# EAGLE design 3-channel_geo_amplifier (EAGLE 7.2.0)
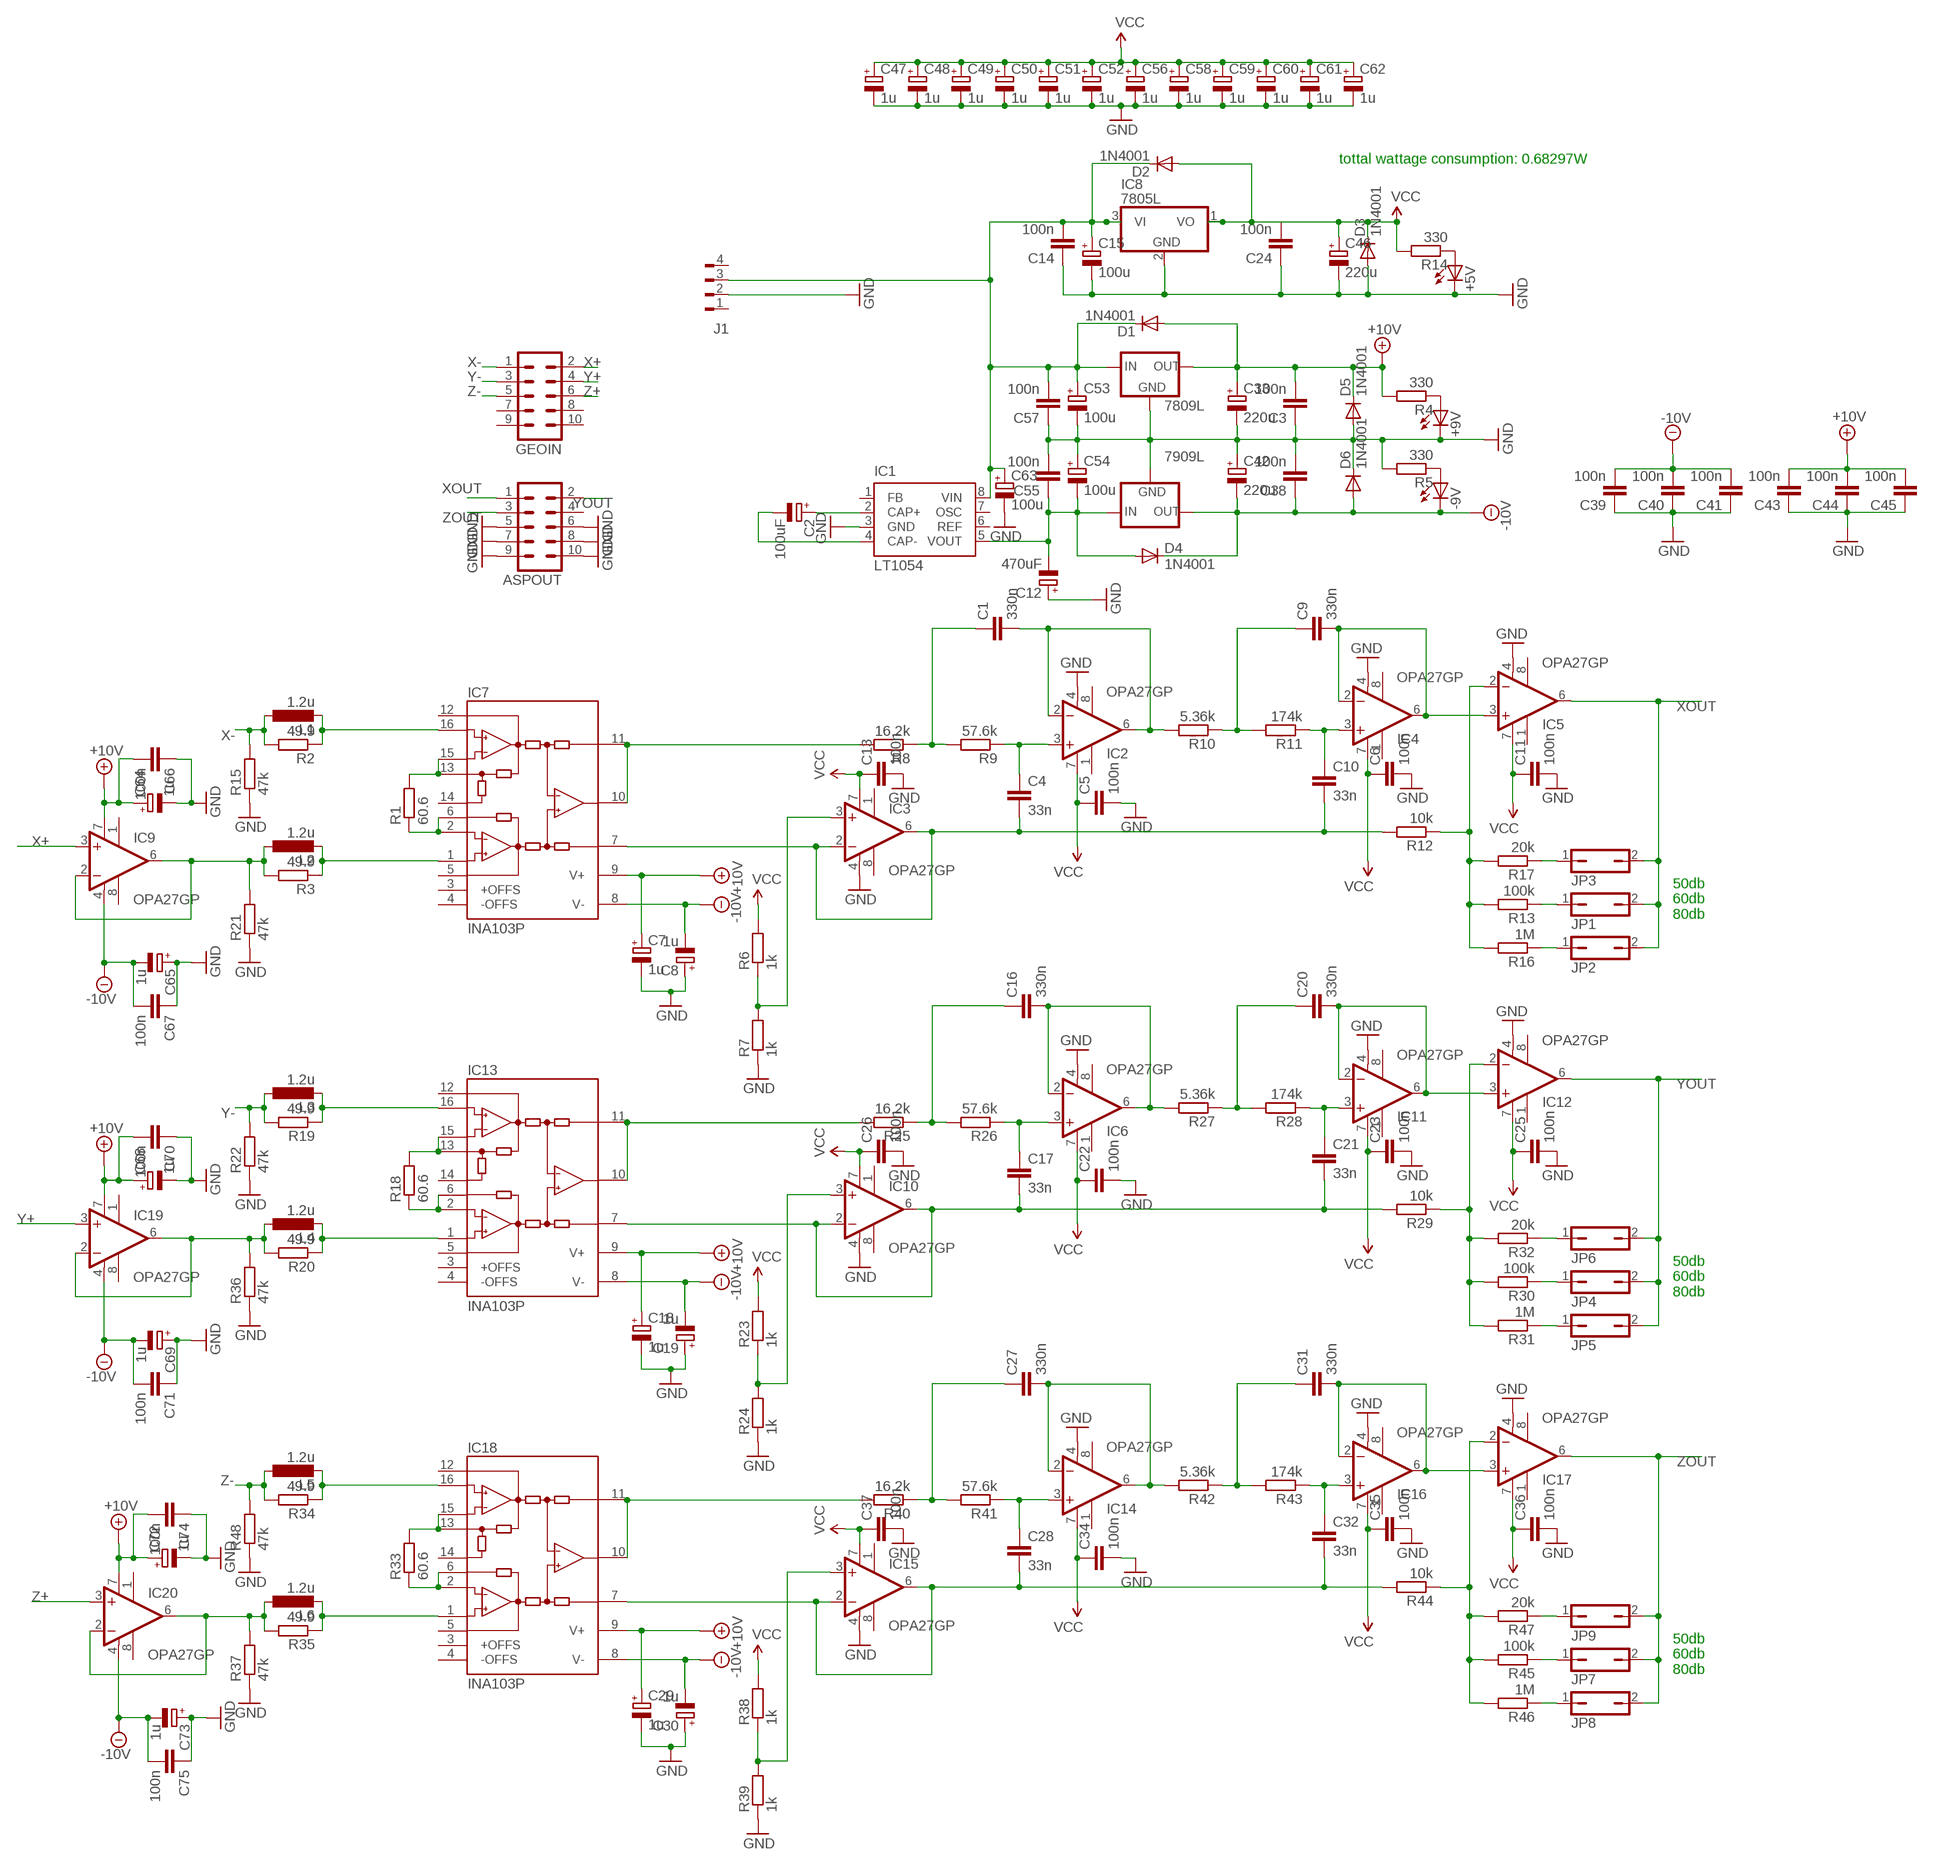
[diagram p0: schematic, sheet 1]

## Parts
7809L  78LXX  [78LXX]
7909L  79LXX  [79LXX]
+5V  LED3MM  [LED3MM]
+9V  LED3MM  [LED3MM]
-9V  LED3MM  [LED3MM]
ASPOUT  ML10  [ML10]
C1  330n  C-EU050-025X075  [C050-025X075]
C2  100uF  CPOL-EUE2.5-7  [E2,5-7]
C3  100n  C-EU050-025X075  [C050-025X075]
C4  33n  C-EU050-025X075  [C050-025X075]
C5  100n  C-EU050-025X075  [C050-025X075]
C6  100n  C-EU050-025X075  [C050-025X075]
C7  1u  CPOL-EUB45181A  [B45181A]
C8  1u  CPOL-EUB45181A  [B45181A]
C9  330n  C-EU050-025X075  [C050-025X075]
C10  33n  C-EU050-025X075  [C050-025X075]
C11  100n  C-EU050-025X075  [C050-025X075]
C12  470uF  CPOL-EUE5-8.5  [E5-8,5]
C13  100n  C-EU050-025X075  [C050-025X075]
C14  100n  C-EU050-025X075  [C050-025X075]
C15  100u  CPOL-EUE2.5-7  [E2,5-7]
C16  330n  C-EU050-025X075  [C050-025X075]
C17  33n  C-EU050-025X075  [C050-025X075]
C18  1u  CPOL-EUB45181A  [B45181A]
C19  1u  CPOL-EUB45181A  [B45181A]
C20  330n  C-EU050-025X075  [C050-025X075]
C21  33n  C-EU050-025X075  [C050-025X075]
C22  100n  C-EU050-025X075  [C050-025X075]
C23  100n  C-EU050-025X075  [C050-025X075]
C24  100n  C-EU050-025X075  [C050-025X075]
C25  100n  C-EU050-025X075  [C050-025X075]
C26  100n  C-EU050-025X075  [C050-025X075]
C27  330n  C-EU050-025X075  [C050-025X075]
C28  33n  C-EU050-025X075  [C050-025X075]
C29  1u  CPOL-EUB45181A  [B45181A]
C30  1u  CPOL-EUB45181A  [B45181A]
C31  330n  C-EU050-025X075  [C050-025X075]
C32  33n  C-EU050-025X075  [C050-025X075]
C33  220u  CPOL-EUE2.5-5  [E2,5-5]
C34  100n  C-EU050-025X075  [C050-025X075]
C35  100n  C-EU050-025X075  [C050-025X075]
C36  100n  C-EU050-025X075  [C050-025X075]
C37  100n  C-EU050-025X075  [C050-025X075]
C38  100n  C-EU050-025X075  [C050-025X075]
C39  100n  C-EU050-025X075  [C050-025X075]
C40  100n  C-EU050-025X075  [C050-025X075]
C41  100n  C-EU050-025X075  [C050-025X075]
C42  220u  CPOL-EUE2.5-5  [E2,5-5]
C43  100n  C-EU050-025X075  [C050-025X075]
C44  100n  C-EU050-025X075  [C050-025X075]
C45  100n  C-EU050-025X075  [C050-025X075]
C46  220u  CPOL-EUE2.5-7  [E2,5-7]
C47  1u  CPOL-EUB45181A  [B45181A]
C48  1u  CPOL-EUB45181A  [B45181A]
C49  1u  CPOL-EUB45181A  [B45181A]
C50  1u  CPOL-EUB45181A  [B45181A]
C51  1u  CPOL-EUB45181A  [B45181A]
C52  1u  CPOL-EUB45181A  [B45181A]
C53  100u  CPOL-EUE2.5-5  [E2,5-5]
C54  100u  CPOL-EUE2.5-5  [E2,5-5]
C55  100n  C-EU050-025X075  [C050-025X075]
C56  1u  CPOL-EUB45181A  [B45181A]
C57  100n  C-EU050-025X075  [C050-025X075]
C58  1u  CPOL-EUB45181A  [B45181A]
C59  1u  CPOL-EUB45181A  [B45181A]
C60  1u  CPOL-EUB45181A  [B45181A]
C61  1u  CPOL-EUB45181A  [B45181A]
C62  1u  CPOL-EUB45181A  [B45181A]
C63  100u  CPOL-EUE2.5-5  [E2,5-5]
C64  1u  CPOL-EUB45181A  [B45181A]
C65  1u  CPOL-EUB45181A  [B45181A]
C66  100n  C-EU050-025X075  [C050-025X075]
C67  100n  C-EU050-025X075  [C050-025X075]
C68  1u  CPOL-EUB45181A  [B45181A]
C69  1u  CPOL-EUB45181A  [B45181A]
C70  100n  C-EU050-025X075  [C050-025X075]
C71  100n  C-EU050-025X075  [C050-025X075]
C72  1u  CPOL-EUB45181A  [B45181A]
C73  1u  CPOL-EUB45181A  [B45181A]
C74  100n  C-EU050-025X075  [C050-025X075]
C75  100n  C-EU050-025X075  [C050-025X075]
D1  1N4001  1N4004  [DO41-10]
D2  1N4001  1N4004  [DO41-10]
D3  1N4001  1N4004  [DO41-10]
D4  1N4001  1N4004  [DO41-10]
D5  1N4001  1N4004  [DO41-10]
D6  1N4001  1N4004  [DO41-10]
GEOIN  ML10  [ML10]
IC1  LT1054  [DIL8]
IC2  OPA27GP  [DIL08]
IC3  OPA27GP  [DIL08]
IC4  OPA27GP  [DIL08]
IC5  OPA27GP  [DIL08]
IC6  OPA27GP  [DIL08]
IC7  INA103P  [DIL16]
IC8  7805L  [TO92]
IC9  OPA27GP  [DIL08]
IC10  OPA27GP  [DIL08]
IC11  OPA27GP  [DIL08]
IC12  OPA27GP  [DIL08]
IC13  INA103P  [DIL16]
IC14  OPA27GP  [DIL08]
IC15  OPA27GP  [DIL08]
IC16  OPA27GP  [DIL08]
IC17  OPA27GP  [DIL08]
IC18  INA103P  [DIL16]
IC19  OPA27GP  [DIL08]
IC20  OPA27GP  [DIL08]
J1  FLOP-4W827001  [827001]
JP1  JP1Q  [JP1]
JP2  JP1Q  [JP1]
JP3  JP1Q  [JP1]
JP4  JP1Q  [JP1]
JP5  JP1Q  [JP1]
JP6  JP1Q  [JP1]
JP7  JP1Q  [JP1]
JP8  JP1Q  [JP1]
JP9  JP1Q  [JP1]
L1  1.2u  L-EU0207/10  [0207/10]
L2  1.2u  L-EU0207/10  [0207/10]
L3  1.2u  L-EU0207/10  [0207/10]
L4  1.2u  L-EU0207/10  [0207/10]
L5  1.2u  L-EU0207/10  [0207/10]
L6  1.2u  L-EU0207/10  [0207/10]
R1  60.6  R-EU_0207/10  [0207/10]
R2  49.9  R-EU_0207/10  [0207/10]
R3  49.9  R-EU_0207/10  [0207/10]
R4  330  R-EU_0207/10  [0207/10]
R5  330  R-EU_0207/10  [0207/10]
R6  1k  R-EU_0207/10  [0207/10]
R7  1k  R-EU_0207/10  [0207/10]
R8  16.2k  R-EU_0207/10  [0207/10]
R9  57.6k  R-EU_0207/10  [0207/10]
R10  5.36k  R-EU_0207/10  [0207/10]
R11  174k  R-EU_0207/10  [0207/10]
R12  10k  R-EU_0207/10  [0207/10]
R13  100k  R-EU_0207/10  [0207/10]
R14  330  R-EU_0207/10  [0207/10]
R15  47k  R-EU_0207/10  [0207/10]
R16  1M  R-EU_0207/10  [0207/10]
R17  20k  R-EU_0207/10  [0207/10]
R18  60.6  R-EU_0207/10  [0207/10]
R19  49.9  R-EU_0207/10  [0207/10]
R20  49.9  R-EU_0207/10  [0207/10]
R21  47k  R-EU_0207/10  [0207/10]
R22  47k  R-EU_0207/10  [0207/10]
R23  1k  R-EU_0207/10  [0207/10]
R24  1k  R-EU_0207/10  [0207/10]
R25  16.2k  R-EU_0207/10  [0207/10]
R26  57.6k  R-EU_0207/10  [0207/10]
R27  5.36k  R-EU_0207/10  [0207/10]
R28  174k  R-EU_0207/10  [0207/10]
R29  10k  R-EU_0207/10  [0207/10]
R30  100k  R-EU_0207/10  [0207/10]
R31  1M  R-EU_0207/10  [0207/10]
R32  20k  R-EU_0207/10  [0207/10]
R33  60.6  R-EU_0207/10  [0207/10]
R34  49.9  R-EU_0207/10  [0207/10]
R35  49.9  R-EU_0207/10  [0207/10]
R36  47k  R-EU_0207/10  [0207/10]
R37  47k  R-EU_0207/10  [0207/10]
R38  1k  R-EU_0207/10  [0207/10]
R39  1k  R-EU_0207/10  [0207/10]
R40  16.2k  R-EU_0207/10  [0207/10]
R41  57.6k  R-EU_0207/10  [0207/10]
R42  5.36k  R-EU_0207/10  [0207/10]
R43  174k  R-EU_0207/10  [0207/10]
R44  10k  R-EU_0207/10  [0207/10]
R45  100k  R-EU_0207/10  [0207/10]
R46  1M  R-EU_0207/10  [0207/10]
R47  20k  R-EU_0207/10  [0207/10]
R48  47k  R-EU_0207/10  [0207/10]

## Nets
+10V [power]: 7809L.OUT C3.2 C7.+ C18.+ C29.+ C33.+ C43.2 C44.2 C45.2 C64.+ C66.2 C68.+ C70.2 C72.+ C74.2 D1.A D5.C IC7.9(V+) IC9.7(V+) IC13.9(V+) IC18.9(V+) IC19.7(V+) IC20.7(V+) R4.2
-10V [power]: 7909L.OUT -9V.K(C) C8.- C19.- C30.- C38.1 C39.2 C40.2 C41.2 C42.- C65.- C67.2 C69.- C71.2 C73.- C75.2 D4.C D6.A IC7.8(V-) IC9.4(V-) IC13.8(V-) IC18.8(V-) IC19.4(V-) IC20.4(V-)
A: IC20.2(-IN) IC20.6(OUT) L6.1 R35.2 R37.2
GND [power]: 7809L.GND 7909L.GND +5V.K(C) +9V.K(C) ASPOUT.5 ASPOUT.6 ASPOUT.7 ASPOUT.8 ASPOUT.9 ASPOUT.10 C3.1 C5.2 C6.2 C7.- C8.+ C11.2 C12.+ C13.2 C14.1 C15.- C18.- C19.+ C22.2 C23.2 C24.1 C25.2 C26.2 C29.- C30.+ C33.- C34.2 C35.2 C36.2 C37.2 C38.2 C39.1 C40.1 C41.1 C42.+ C43.1 C44.1 C45.1 C46.- C47.- C48.- C49.- C50.- C51.- C52.- C53.- C54.+ C55.2 C56.- C57.1 C58.- C59.- C60.- C61.- C62.- C63.- C64.- C65.+ C66.1 C67.1 C68.- C69.+ C70.1 C71.1 C72.- C73.+ C74.1 C75.1 D3.A D5.A D6.C IC1.3(GND) IC2.4(V-) IC3.4(V-) IC4.4(V-) IC5.4(V-) IC6.4(V-) IC8.2(GND) IC10.4(V-) IC11.4(V-) IC12.4(V-) IC14.4(V-) IC15.4(V-) IC16.4(V-) IC17.4(V-) J1.2 R5.2 R7.1 R15.1 R21.1 R22.1 R24.1 R36.1 R37.1 R39.1 R48.1
N$1: IC7.13(-RG) IC7.15(-GS) R1.2
N$2: IC7.2(+GS) IC7.6(+RG) R1.1
N$3: IC7.1(+IN) L2.2 R3.1
N$4: IC19.2(-IN) IC19.6(OUT) L4.1 R20.2 R36.2
N$6: IC7.16(-IN) L1.2 R2.1
N$7: C4.2 C10.2 IC3.2(-IN) IC3.6(OUT) IC7.7(REF) R12.2
N$8: IC3.3(+IN) R6.1 R7.2
N$9: IC7.10(OUT) IC7.11(SENSE) R8.2
N$10: C1.1 R8.1 R9.2
N$11: C4.1 IC2.3(+IN) R9.1
N$12: C1.2 IC2.2(-IN) IC2.6(OUT) R10.2
N$13: C9.2 IC4.2(-IN) IC4.6(OUT) IC5.3(+IN)
N$14: C9.1 R10.1 R11.2
N$15: C10.1 IC4.3(+IN) R11.1
N$16: +5V.A R14.1
N$17: IC5.2(-IN) R12.1 R13.2 R16.2 R17.2
N$18: JP1.1 R13.1
N$19: IC9.2(-IN) IC9.6(OUT) L2.1 R3.2 R21.2
N$20: +9V.A R4.1
N$21: IC13.13(-RG) IC13.15(-GS) R18.2
N$22: JP2.1 R16.1
N$23: IC13.2(+GS) IC13.6(+RG) R18.1
N$24: JP3.1 R17.1
N$25: IC13.1(+IN) L4.2 R20.1
N$26: C2.- IC1.4(CAP-)
N$27: C2.+ IC1.2(CAP+)
N$28: IC13.16(-IN) L3.2 R19.1
N$29: C17.2 C21.2 IC10.2(-IN) IC10.6(OUT) IC13.7(REF) R29.2
N$30: IC10.3(+IN) R23.1 R24.2
N$31: IC13.10(OUT) IC13.11(SENSE) R25.2
N$32: C16.1 R25.1 R26.2
N$33: C17.1 IC6.3(+IN) R26.1
N$34: C16.2 IC6.2(-IN) IC6.6(OUT) R27.2
N$35: C20.1 R27.1 R28.2
N$36: C21.1 IC11.3(+IN) R28.1
N$37: C20.2 IC11.2(-IN) IC11.6(OUT) IC12.3(+IN)
N$38: IC12.2(-IN) R29.1 R30.2 R31.2 R32.2
N$39: -9V.A R5.1
N$40: JP4.1 R30.1
N$41: JP5.1 R31.1
N$42: JP6.1 R32.1
N$43: IC18.13(-RG) IC18.15(-GS) R33.2
N$44: IC18.2(+GS) IC18.6(+RG) R33.1
N$45: IC18.1(+IN) L6.2 R35.1
N$46 [power]: 7809L.IN C14.2 C15.+ C53.+ C57.2 C63.+ D1.C D2.C IC1.8(VIN) IC8.3(VI) J1.3
N$52: IC18.16(-IN) L5.2 R34.1
N$53: C28.2 C32.2 IC15.2(-IN) IC15.6(OUT) IC18.7(REF) R44.2
N$54: IC15.3(+IN) R38.1 R39.2
N$55: IC18.10(OUT) IC18.11(SENSE) R40.2
N$56: C27.1 R40.1 R41.2
N$57: C28.1 IC14.3(+IN) R41.1
N$58 [power]: 7909L.IN C12.- C54.- C55.1 D4.A IC1.5(VOUT)
N$60: C27.2 IC14.2(-IN) IC14.6(OUT) R42.2
N$61: C31.1 R42.1 R43.2
N$62: C32.1 IC16.3(+IN) R43.1
N$63: C31.2 IC16.2(-IN) IC16.6(OUT) IC17.3(+IN)
N$64: IC17.2(-IN) R44.1 R45.2 R46.2 R47.2
N$66: JP7.1 R45.1
N$67: JP8.1 R46.1
N$68: JP9.1 R47.1
VCC [power]: C5.1 C6.1 C11.1 C13.1 C22.1 C23.1 C24.2 C25.1 C26.1 C34.1 C35.1 C36.1 C37.1 C46.+ C47.+ C48.+ C49.+ C50.+ C51.+ C52.+ C56.+ C58.+ C59.+ C60.+ C61.+ C62.+ D2.A D3.C IC2.7(V+) IC3.7(V+) IC4.7(V+) IC5.7(V+) IC6.7(V+) IC8.1(VO) IC10.7(V+) IC11.7(V+) IC12.7(V+) IC14.7(V+) IC15.7(V+) IC16.7(V+) IC17.7(V+) R6.2 R14.2 R23.2 R38.2
X+: GEOIN.2 IC9.3(+IN)
X-: GEOIN.1 L1.1 R2.2 R15.2
XOUT: ASPOUT.1 IC5.6(OUT) JP1.2 JP2.2 JP3.2
Y+: GEOIN.4 IC19.3(+IN)
Y-: GEOIN.3 L3.1 R19.2 R22.2
YOUT: ASPOUT.2 IC12.6(OUT) JP4.2 JP5.2 JP6.2
Z+: GEOIN.6 IC20.3(+IN)
Z-: GEOIN.5 L5.1 R34.2 R48.2
ZOUT: ASPOUT.3 IC17.6(OUT) JP7.2 JP8.2 JP9.2
Unconnected: ASPOUT.4 GEOIN.7 GEOIN.8 GEOIN.9 GEOIN.10 IC1.1(FB) IC1.6(REF) IC1.7(OSC) IC2.1(OFF1) IC2.8(OFF2) IC3.1(OFF1) IC3.8(OFF2) IC4.1(OFF1) IC4.8(OFF2) IC5.1(OFF1) IC5.8(OFF2) IC6.1(OFF1) IC6.8(OFF2) IC7.3(+OFFS) IC7.4(-OFFS) IC7.5(+GD) IC7.12(-GD) IC7.14(G=100) IC9.1(OFF1) IC9.8(OFF2) IC10.1(OFF1) IC10.8(OFF2) IC11.1(OFF1) IC11.8(OFF2) IC12.1(OFF1) IC12.8(OFF2) IC13.3(+OFFS) IC13.4(-OFFS) IC13.5(+GD) IC13.12(-GD) IC13.14(G=100) IC14.1(OFF1) IC14.8(OFF2) IC15.1(OFF1) IC15.8(OFF2) IC16.1(OFF1) IC16.8(OFF2) IC17.1(OFF1) IC17.8(OFF2) IC18.3(+OFFS) IC18.4(-OFFS) IC18.5(+GD) IC18.12(-GD) IC18.14(G=100) IC19.1(OFF1) IC19.8(OFF2) IC20.1(OFF1) IC20.8(OFF2) J1.1 J1.4

## Notes on the sheet
- tottal wattage consumption: 0.68297W
- 50db
  60db
  80db
- 50db
  60db
  80db
- 50db
  60db
  80db

## Library data of the parts
7809L = v-reg:78LXX: VOLTAGE REGULATOR
7909L = v-reg:79LXX: VOLTAGE REGULATOR
+5V +9V -9V = led:LED: LED OSRAM: - CHIPLED LG R971, LG N971, LY N971, LG Q971, LY Q971, LO R971, LY R971 LH N974, LH R974 LS Q976, LO Q976, LY Q976 LO Q996 - Hyper CHIPLED LW Q18S LB Q993, LB Q99A, LB R99A - SideLED LS A670, LO A670, LY A670, LG A670, LP A670 LB A673, LV A673, LT A673, LW A673 LH A674 LY A675 LS A676, LA A676, LO A676, LY A676, LW A676 LS A679, LY A679, LG A679 - Hyper Micro SIDELED® LS Y876, LA Y876, LO Y876, LY Y876 LT Y87S - SmartLED LW L88C, LW L88S LB L89C, LB L89S, LG L890 LS L89K, LO L89K, LY L89K LS L896, LA L896, LO L896, LY L896 - TOPLED LS T670, LO T670, LY T670, LG T670, LP T670 LSG T670, LSP T670, LSY T670, LOP T670, LYG T670 LG T671, LOG T671, LSG T671 LB T673, LV T673, LT T673, LW T673 LH T674 LS T676, LA T676, LO T676, LY T676, LB T676, LH T676, LSB T676, LW T676 LB T67C, LV T67C, LT T67C, LS T67K, LO T67K, LY T67K, LW E67C LS E67B, LA E67B, LO E67B, LY E67B, LB E67C, LV E67C, LT E67C LW T67C LS T679, LY T679, LG T679 LS T770, LO T770, LY T770, LG T770, LP T770 LB T773, LV T773, LT T773, LW T773 LH T774 LS E675, LA E675, LY E675, LS T675 LS T776, LA T776, LO T776, LY T776, LB T776 LHGB T686 LT T68C, LB T68C - Hyper Mini TOPLED® LB M676 - Mini TOPLED Santana® LG M470 LS M47K, LO M47K, LY M47K Source: http://www.osram.convergy.de LUXEON: - LUMILED® LXK2-PW12-R00, LXK2-PW12-S00, LXK2-PW14-U00, LXK2-PW14-V00 LXK2-PM12-R00, LXK2-PM12-S00, LXK2-PM14-U00 LXK2-PE12-Q00, LXK2-PE12-R00, LXK2-PE12-S00, LXK2-PE14-T00, LXK2-PE14-U00 LXK2-PB12-K00, LXK2-PB12-L00, LXK2-PB12-M00, LXK2-PB14-N00, LXK2-PB14-P00, LXK2-PB14-Q00 LXK2-PR12-L00, LXK2-PR12-M00, LXK2-PR14-Q00, LXK2-PR14-R00 LXK2-PD12-Q00, LXK2-PD12-R00, LXK2-PD12-S00 LXK2-PH12-R00, LXK2-PH12-S00 LXK2-PL12-P00, LXK2-PL12-Q00, LXK2-PL12-R00 Source: www.luxeon.com KINGBRIGHT: KA-3528ASYC Source: www.kingbright.com
ASPOUT GEOIN = con-ml:ML10: HARTING; OC_FARNELL: unknown; OC_NEWARK: unknown
C1 C3-C6 C9-C11 C13 C14 C16 C17 C20-C28 C31 C32 C34-C41 C43-C45 C55 C57 C66 C67 C70 C71 C74 C75 = rcl:C-EU: CAPACITOR, European symbol
C2 C7 C8 C12 C15 C18 C19 C29 C30 C33 C42 C46-C54 C56 C58-C65 C68 C69 C72 C73 = rcl:CPOL-EU: POLARIZED CAPACITOR, European symbol
D1-D6 = diode:1N4004: DIODE general purpose rectifier, 1 A
IC1 = mylib2:LT1054
IC2-IC6 IC9-IC12 IC14-IC17 IC19 IC20 = linear:OPA*?: Ultra-Low Noise, Precision OP AMP Source: http://focus.ti.com/lit/ds/symlink/opa27.pdf http://focus.ti.com .. opa241.pdf
IC7 IC13 IC18 = burr-brown:INA103: Instrumentation Amplifier Low Distortion, Low Noise; MF: TEXAS INSTRUMENTS; MPN: INA103KP; OC_FARNELL: 1212392; OC_NEWARK: 74K3805
IC8 = linear:78*: Positive VOLTAGE REGULATOR Source: http://cache.national.com/ds/LM/LM78L05.pdf http://www.fairchildsemi.com/ds/LM/LM7805.pdf
J1 = con-amp:FLOP-4W: MATE N-LOCK Floppy / HDD conector Distributor: Bürklin 71F972
JP1-JP9 = jumper:JP1Q: JUMPER
L1-L6 = rcl:L-EU: INDUCTOR, European symbol
R1-R48 = rcl:R-EU_: RESISTOR, European symbol

## Net classes
0 default: clearance 0.205 mm
2 power: width 0.559 mm, clearance 0.205 mm to class 0, clearance 0.205 mm to class 1, clearance 0.205 mm
3 extra_power: width 0.762 mm, clearance 0.203 mm

## Board
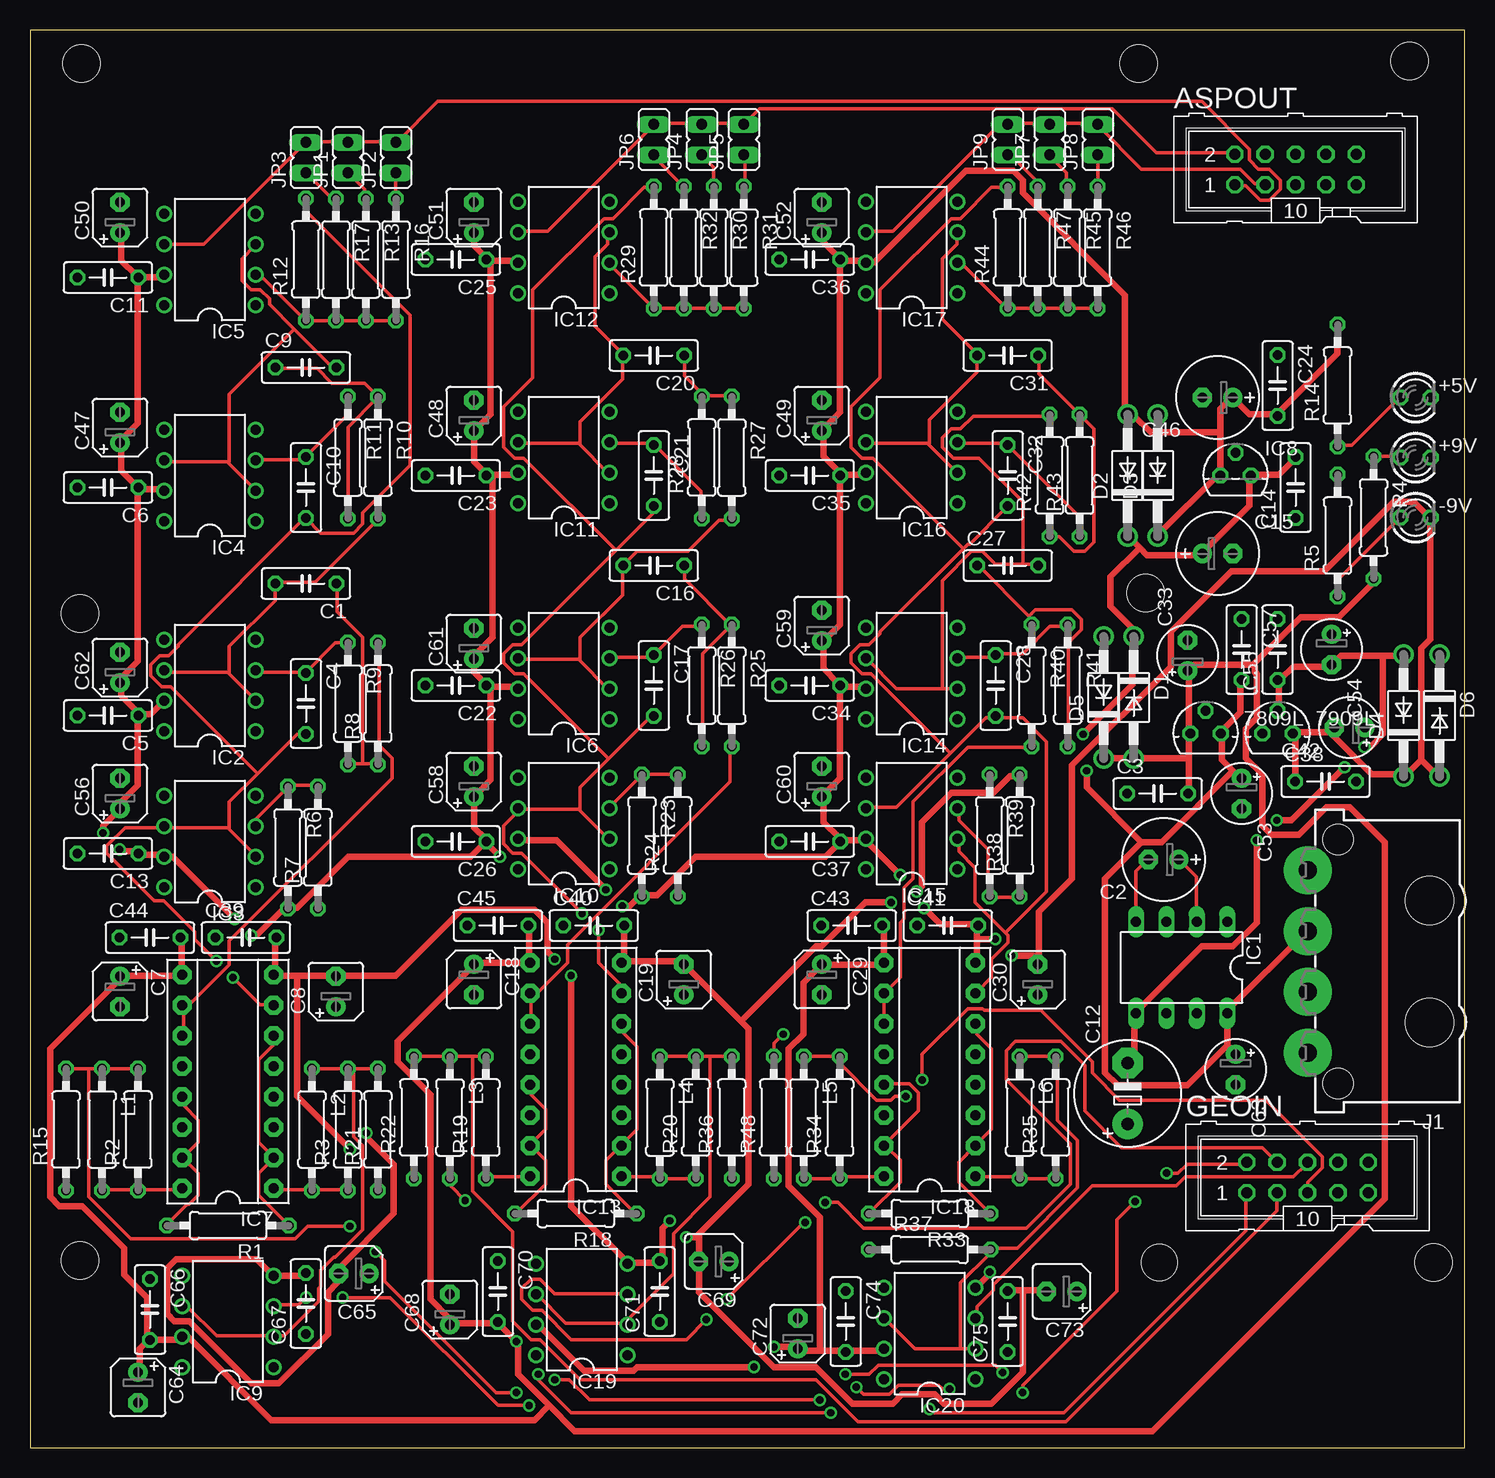
[diagram p1: board, top side]
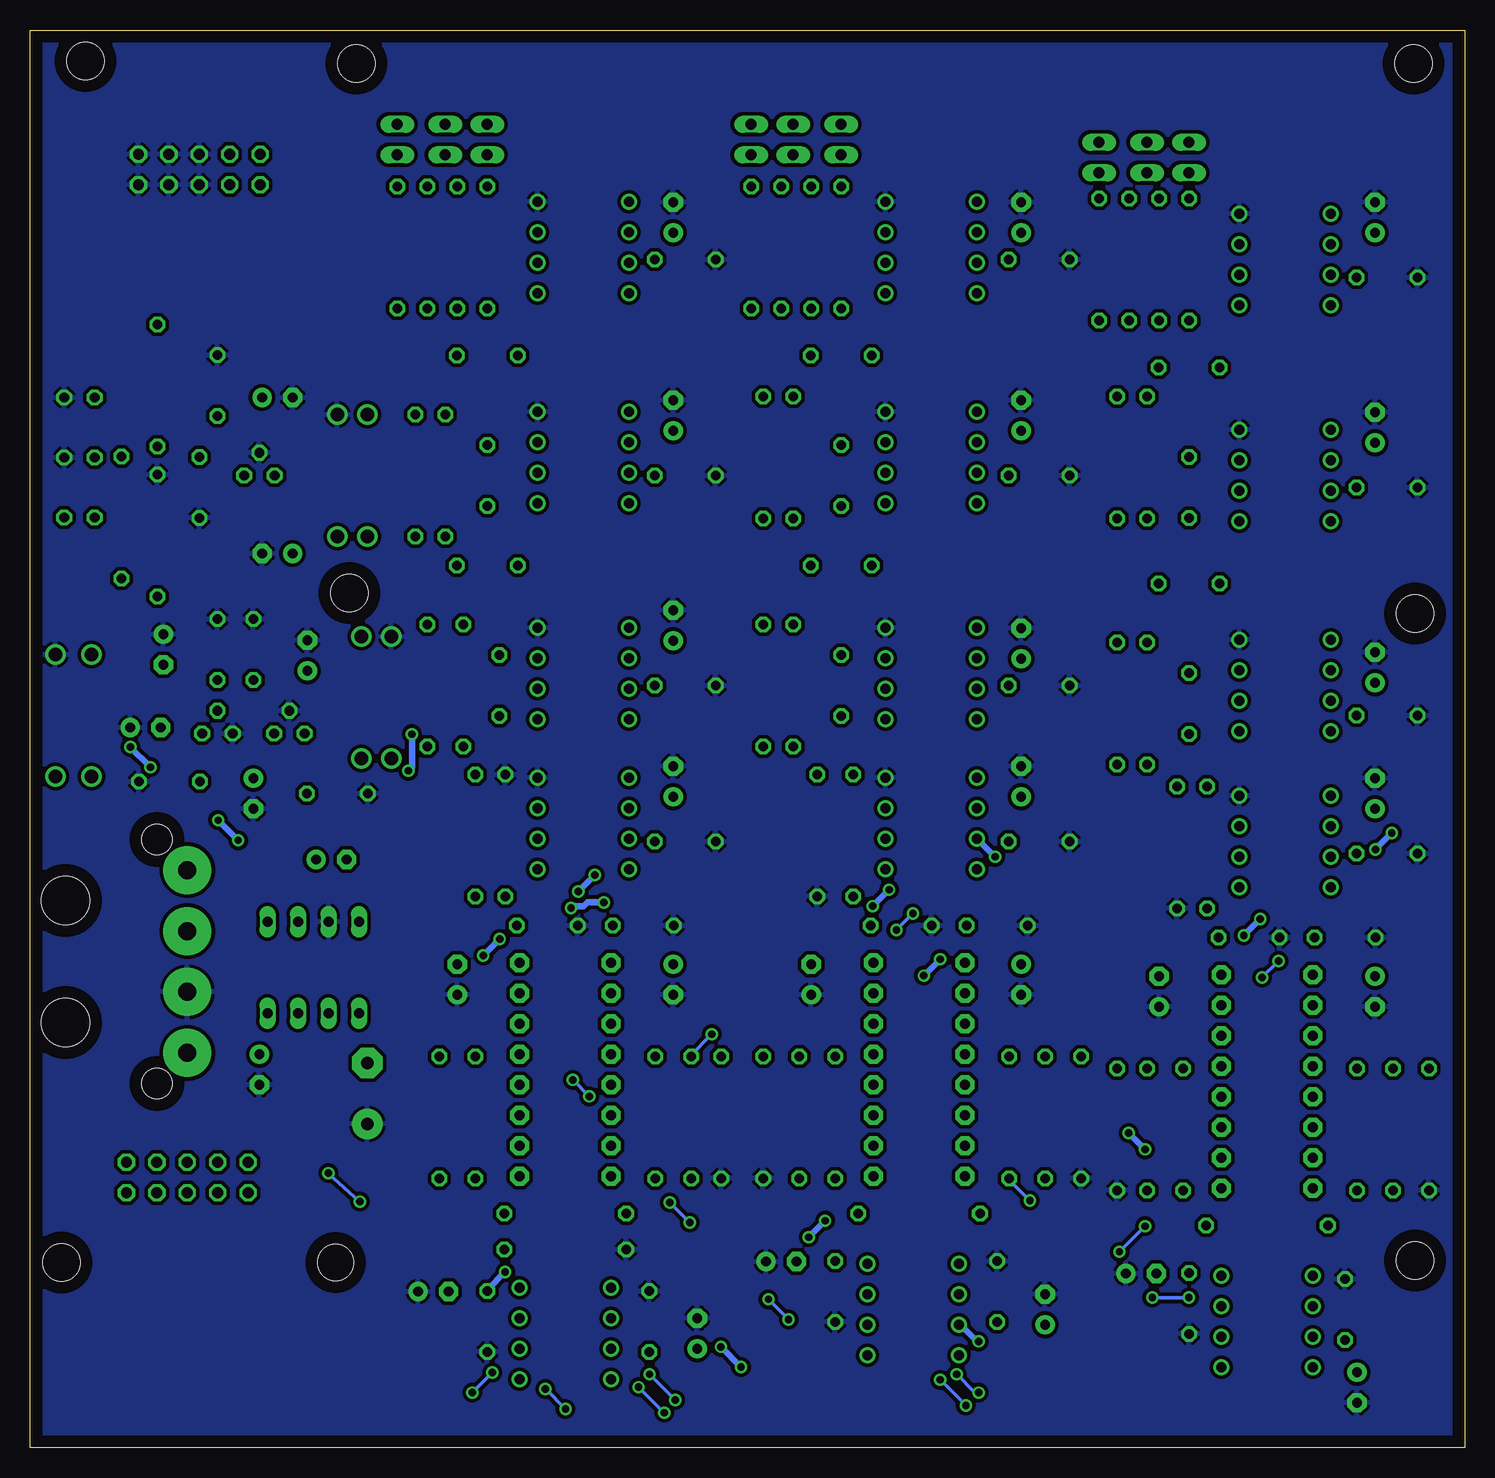
[diagram p2: board, bottom side, seen from below]

Size 119.62 x 118.13 mm. Coordinates in mm from the lower left corner, seen from the top.
Outline: 0,0 119.62,0 119.62,118.13 0,118.09 0,0
Copper layers (1*16): Top 0.035mm / dielectric 1.5mm / Bottom 0.035mm
Design rules "default *": minimum track width 12mil, minimum drill 24mil, track to track 12mil, track to pad 12mil, pad to pad 12mil, via to via 12mil, smd to smd 12mil, copper to edge 40mil, drill to drill 8mil, minimum pad ring 10mil, minimum via ring 8mil, stop-mask expansion 4mil, vias tented up to drill 0mil, thermal gap 10mil
Holes 3 mm at 94.15,15.42
Holes 3.1 mm at 4.29,115.32 92.41,115.34 4.18,15.6 4.18,69.5 93,71.22 117.01,15.42 115,115.55

### Footprints (pad centres in the part's own frame; a part is rotated, then mirrored left to right if it is on the bottom)
78LXX = drill 0.813 octagon: GND 0,1.905; IN 1.27,0; OUT -1.27,0
79LXX = drill 0.813 octagon: GND -1.27,0; IN 0,1.905; OUT 1.27,0
LED3MM = drill 0.813 octagon: A -1.27,0; K 1.27,0
ML10 = drill 0.914 octagon: 1 -5.08,-1.27; 2 -5.08,1.27; 3 -2.54,-1.27; 4 -2.54,1.27; 5 0,-1.27; 6 0,1.27; 7 2.54,-1.27; 8 2.54,1.27; 9 5.08,-1.27; 10 5.08,1.27
C050-025X075 = drill 0.813 octagon: 1 -2.54,0; 2 2.54,0
E2,5-7 = drill 0.813 pad 1.6: + -1.27,0 | drill 0.813 pad 1.6 octagon: - 1.27,0
B45181A = drill 0.813 pad 1.6: + -1.27,0 | drill 0.813 pad 1.6 octagon: - 1.27,0
E5-8,5 = drill 1.016 pad 2.54: + -2.54,0 | drill 1.016 pad 2.54 octagon: - 2.54,0
E2,5-5 = drill 0.813 pad 1.6: + -1.27,0 | drill 0.813 pad 1.6 octagon: - 1.27,0
DO41-10 = drill 1.118: A 5.08,0; C -5.08,0
DIL8 = drill 0.813 long: 1 -3.81,-3.81; 2 -1.27,-3.81; 3 1.27,-3.81; 4 3.81,-3.81; 5 3.81,3.81; 6 1.27,3.81; 7 -1.27,3.81; 8 -3.81,3.81
DIL08 = drill 0.813 pad 1.27: 1 -3.81,-3.81; 2 -1.27,-3.81; 3 1.27,-3.81; 4 3.81,-3.81; 5 3.81,3.81; 6 1.27,3.81; 7 -1.27,3.81; 8 -3.81,3.81
DIL16 = drill 0.813 pad 1.6 octagon: 1 -8.89,-3.81; 2 -6.35,-3.81; 3 -3.81,-3.81; 4 -1.27,-3.81; 5 1.27,-3.81; 6 3.81,-3.81; 7 6.35,-3.81; 8 8.89,-3.81; 9 8.89,3.81; 10 6.35,3.81; 11 3.81,3.81; 12 1.27,3.81; 13 -1.27,3.81; 14 -3.81,3.81; 15 -6.35,3.81; 16 -8.89,3.81
TO92 = drill 0.813 octagon: 1 -1.27,0; 2 0,1.905; 3 1.27,0
827001 = drill 1.5 pad 4: 1 -7.62,0; 2 -2.54,0; 3 2.54,0; 4 7.62,0 | hole 4: 5.08,-10.16; -5.08,-10.16 | hole 2.5: 10.16,-2.54; -10.16,-2.54
JP1 = drill 0.914 long: 1 0,-1.27; 2 0,1.27
0207/10 = drill 0.813 octagon: 1 -5.08,0; 2 5.08,0

### Placement (x,y rotation side)
7809L  98,59.5 0 top
7909L  104,59.5 0 top
+5V  115.5,87.5 0 top
+9V  115.5,82.5 0 top
-9V  115.5,77.5 0 top
ASPOUT  105.5,106.5 0 top
C1  23,72 180 top
C2  94.5,49 180 top
C3  94,54.5 0 top
C4  23,62 270 top
C5  6.5,61 180 top
C6  6.5,80 180 top
C7  7.5,38 270 top
C8  25.5,38 90 top
C9  23,90 0 top
C10  23,80 270 top
C11  6.5,97.5 180 top
C12  91.5,29.5 90 top
C13  6.5,49.5 180 top
C14  105.5,80 90 top
C15  99,74.5 0 top
C16  52,73.5 180 top
C17  52,63.5 270 top
C18  37,39 270 top
C19  54.5,39 90 top
C20  52,91 180 top
C21  52,81 270 top
C22  35.5,63.5 180 top
C23  35.5,81 180 top
C24  104,88.5 270 top
C25  35.5,99 180 top
C26  35.5,50.5 180 top
C27  81.5,73.5 0 top
C28  80.5,63.5 270 top
C29  66,39 270 top
C30  84,39 90 top
C31  81.5,91 180 top
C32  81.5,81 270 top
C33  96.5,66 90 top
C34  65,63.5 180 top
C35  65,81 180 top
C36  65,99 180 top
C37  65,50.5 180 top
C38  108,55.5 0 top
C39  18,42.5 0 top
C40  47,43.5 0 top
C41  76.5,43.5 0 top
C42  110,60 180 top
C43  68.5,43.5 0 top
C44  10,42.5 0 top
C45  39,43.5 0 top
C46  99,87.5 180 top
C47  7.5,85 90 top
C48  37,86 90 top
C49  66,86 90 top
C50  7.5,102.5 90 top
C51  37,102.5 90 top
C52  66,102.5 90 top
C53  101,54.5 270 top
C54  108.5,66.5 270 top
C55  104,66.5 90 top
C56  7.5,54.5 90 top
C57  101,66.5 270 top
C58  37,55.5 90 top
C59  66,68.5 90 top
C60  66,55.5 90 top
C61  37,67 90 top
C62  7.5,65 90 top
C63  100.5,31.5 270 top
C64  9,5 270 top
C65  27,14.5 180 top
C66  10,11.5 270 top
C67  23,12 90 top
C68  35,11.5 90 top
C69  57,15.5 180 top
C70  39,13 270 top
C71  52.5,13 90 top
C72  64,9.5 90 top
C73  86,13 180 top
C74  68,10.5 270 top
C75  81.5,10.5 90 top
D1  92,62.5 270 top
D2  91.5,81 90 top
D3  94,81 90 top
D4  114.5,61 90 top
D5  89.5,62.5 90 top
D6  117.5,61 270 top
GEOIN  106.5,22.5 0 top
IC1  96,40 180 top
IC2  15,63.5 90 top
IC3  15,50.5 90 top
IC4  15,81 90 top
IC5  15,99 90 top
IC6  44.5,64.5 90 top
IC7  16.5,30.5 90 top
IC8  100.5,81 0 top
IC9  16.5,10.5 90 top
IC10  44.5,52 90 top
IC11  44.5,82.5 90 top
IC12  44.5,100 90 top
IC13  45.5,31.5 90 top
IC14  73.5,64.5 90 top
IC15  73.5,52 90 top
IC16  73.5,82.5 90 top
IC17  73.5,100 90 top
IC18  75,31.5 90 top
IC19  46,11.5 90 top
IC20  75,9.5 90 top
J1  106.5,40.5 90 top
JP1  26.5,107.5 0 top
JP2  30.5,107.5 0 top
JP3  23,107.5 0 top
JP4  56,109 0 top
JP5  59.5,109 0 top
JP6  52,109 0 top
JP7  85,109 0 top
JP8  89,109 0 top
JP9  81.5,109 0 top
L1  6,26.5 270 top
L2  23.5,26.5 270 top
L3  35,27.5 270 top
L4  52.5,27.5 270 top
L5  64.5,27.5 270 top
L6  82.5,27.5 270 top
R1  16.5,18.5 180 top
R2  9,26.5 90 top
R3  26.5,26.5 90 top
R4  112,77.5 270 top
R5  109,76 90 top
R6  21.5,50 270 top
R7  24,50 90 top
R8  29,62 90 top
R9  26.5,62 270 top
R10  29,82.5 270 top
R11  26.5,82.5 270 top
R12  23,99 90 top
R13  28,99 270 top
R14  109,88.5 90 top
R15  3,26.5 90 top
R16  30.5,99 270 top
R17  25.5,99 270 top
R18  45.5,19.5 180 top
R19  38,27.5 90 top
R20  55.5,27.5 90 top
R21  29,26.5 90 top
R22  32,27.5 90 top
R23  51,51 270 top
R24  54,51 90 top
R25  58.5,63.5 270 top
R26  56,63.5 270 top
R27  58.5,82.5 270 top
R28  56,82.5 90 top
R29  52,100 90 top
R30  57,100 270 top
R31  59.5,100 270 top
R32  54.5,100 270 top
R33  75,19.5 180 top
R34  67.5,27.5 90 top
R35  85.5,27.5 90 top
R36  58.5,27.5 90 top
R37  75,16.5 0 top
R38  82.5,51 90 top
R39  80,51 270 top
R40  83.5,63.5 270 top
R41  86.5,63.5 270 top
R42  85,81 90 top
R43  87.5,81 90 top
R44  81.5,100 90 top
R45  86.5,100 270 top
R46  89,100 270 top
R47  84,100 270 top
R48  62,27.5 90 top

### Tracks (layer width: path | path; a pad name or v marks a point on that pad's centre or on a via)
+10V  (via drill 0.61)
  Top 0.559: C66.2 10.06,9 12.5,9 12.65,9.15 IC9.7 12.95,9.15 13.26,9.15 20.12,2.29 42.06,2.29 43.28,3.51 | C64.+ 9.14,6.4 9.14,8.23 9.75,8.84 C66.2 | C44.2 12.65,42.37 12.65,39.48 IC7.9 12.5,39.32 7.62,39.32 C7.+ 7.47,39.02 1.68,33.23 1.68,20.88 2.44,20.12 4.35,20.12 7.86,16.62 7.86,14.4 9.75,12.5 9.75,9.15 C66.2 | IC20.7 71.17,8.08 68.12,8.08 C74.2 67.82,8.08 65.84,8.08 | 65.84,8.08 64.01,8.08 C72.+ 63.86,8.38 v62.03,8.38 | C43.2 71.17,43.44 71.17,40.54 IC18.9 71.02,40.24 66.14,40.24 C29.+ 65.84,40.08 64.47,38.71 64.47,34.45 63.25,33.23 63.25,21.8 65.84,19.21 65.84,8.08 | D5.C 89.61,57.46 91.9,57.46 D1.A 92.2,57.46 96.62,57.46 | 96.62,57.46 96.62,59.44 7809L.OUT 96.62,59.74 96.62,64.62 C33.+ 96.62,64.77 97.08,65.23 101.96,65.23 | 96.62,57.46 96.62,54.56 C3.2 | 101.96,65.23 105.92,69.19 109.12,69.19 111.86,71.94 111.86,72.39 R4.2 | C45.2 41.6,43.44 41.6,40.54 IC13.9 41.45,40.39 37.03,40.39 C18.+ 36.88,40.08 30.63,33.84 30.63,32.16 33.38,29.42 33.38,12.35 34.9,10.82 34.9,10.52 C68.+ 35.05,10.37 38.86,10.37 C70.2 39.01,10.37 v40.54,8.84 40.69,8.69 40.69,6.1 43.28,3.51 | 43.28,3.51 45.41,1.38 93.57,1.38 112.93,20.73 112.93,50.45 110.03,53.34 108.05,53.34 105.77,51.06 103.48,51.06 102.72,51.82 102.72,56.09 101.35,57.46 101.35,59.9 102.26,60.81 102.26,64.47 102.11,64.62 102.11,65.08 101.96,65.23 | v60.35,6.71 50.6,6.71 50.29,6.4 46.18,6.4 42.22,10.37 IC19.7
  Bottom 0.559: v40.54,8.84 40.69,8.84 42.06,10.21 IC19.7 | v60.35,6.71 v62.03,8.38
-10V  (via drill 0.61)
  Top 0.559: C38.1 105.46,55.63 105.46,59.29 7909L.OUT 105.31,59.59 108.36,59.59 108.66,59.9 C42.- 108.51,59.44 111.86,56.09 114.3,56.09 D4.C 114.61,55.93 115.98,57.31 | 78.94,42.37 78.94,40.54 IC18.8 | 78.94,42.37 78.94,43.44 C41.2 78.79,43.59 75.89,43.59 v74.52,44.96 | 115.98,57.31 115.98,66.6 116.74,67.36 116.74,77.42 -9V.K 116.59,77.58 115.37,78.79 113.69,78.79 107.9,73 100.13,73 95.1,67.97 95.1,65.08 86.87,56.85 86.87,47.4 84.12,44.66 84.12,40.39 C30.- 83.97,41 v81.84,41 | 115.98,57.31 117.35,55.93 D6.A | v80.47,42.37 78.94,42.37 | C39.2 20.42,42.37 20.42,39.48 IC7.8 20.57,39.32 22.25,39.32 | 22.25,39.32 25.45,39.32 C8.- 25.76,39.32 30.48,39.32 35.97,44.81 42.06,44.81 43.13,43.74 43.13,41.3 v43.74,40.69 | C67.2 22.86,14.48 22.71,14.33 20.42,14.33 IC9.4 20.12,14.48 18.9,15.7 12.19,15.7 11.43,14.94 11.43,11.13 12.04,10.52 13.26,10.52 18.44,5.34 20.73,5.34 24.84,9.45 24.84,12.96 25.6,13.72 25.6,14.48 C65.- 25.76,14.79 25.76,14.94 30.33,19.51 30.33,23.62 28.04,25.91 v28.04,26.22 | 22.25,39.32 22.25,29.26 v26.67,24.84 | 82.75,13.11 84.58,13.11 C73.- | 82.75,13.11 81.53,13.11 C75.2 | v80.01,14.63 80.01,14.48 78.94,13.41 IC20.4 | C40.2 49.53,43.44 49.53,40.69 49.38,40.54 IC13.8 49.68,40.54 54.1,40.54 54.25,40.39 C19.- 54.56,40.24 59.28,35.51 | 55.78,17.53 55.78,17.83 59.89,21.95 59.89,34.9 59.28,35.51 | 55.78,17.53 55.78,15.55 C69.- 55.78,15.24 55.78,12.96 62.03,6.71 65.53,6.71 68.58,3.66 71.93,3.66 72.69,4.42 75.44,4.42 76.2,3.66 80.16,3.66 82.75,6.25 82.75,13.11 | v53.34,18.9 52.73,18.29 52.73,15.7 C71.2 52.43,15.4 49.84,15.4 IC19.4 49.68,15.55 45.11,20.12 v45.11,39.32
  Top 0.559: 55.78,17.53 v54.71,17.53 | v71.78,45.42 69.65,45.42 65.99,41.76 65.53,41.76 59.28,35.51
  Bottom 0.559: v81.84,41 v80.47,42.37 | v28.04,26.22 v26.67,24.84 | v80.01,14.63 81.53,13.11 C75.2 | v54.71,17.53 v53.34,18.9 | v45.11,39.32 v43.74,40.69 | v74.52,44.96 74.37,45.11 73.46,45.11 73.15,45.42 v71.78,45.42
A
  Top 0.305: L6.1 82.6,32.62 85.5,32.62 R35.2 85.65,32.46 85.65,27.28 87.33,25.61 87.33,21.64 82.3,16.62 80.16,16.62 R37.2 80.01,16.46 80.01,16.16 77.57,13.72 77.57,8.23 | 77.57,8.23 73.76,8.23 71.32,10.67 IC20.6 | 77.57,8.23 78.79,8.23 IC20.2
GND
  pour Bottom (isolate 0.305): 120.28,117.99 119.78,-0.25 -0.24,-0.25 0.26,117.99
N$1
  Top 0.305: R1.2 11.43,18.6 13.11,20.27 13.26,20.27 14.02,21.03 14.02,22.86 12.8,24.08 IC7.15 12.8,24.23 14.02,25.45 14.02,27.28 12.8,28.5 12.8,29.11 IC7.13
N$2
  Top 0.305: R1.1 21.49,18.6 19.05,21.03 19.05,22.86 20.27,24.08 IC7.2 20.27,24.23 19.05,25.45 19.05,32.31 20.27,33.53 20.27,34.29 IC7.6
N$3
  Top 0.305: R3.1 26.36,21.49 23.62,21.49 L2.2 23.47,21.49 20.42,21.49 IC7.1
N$4
  Top 0.305: L4.1 52.58,32.62 55.47,32.62 R20.2 55.63,32.62 56.69,32.62 | 56.69,32.62 58.37,32.62 R36.2 | IC19.6 42.22,12.8 44.65,10.37 49.68,10.37 IC19.2 49.68,10.52 53.65,14.48 53.65,17.83 56.69,20.88 56.69,32.62
N$6
  Top 0.305: L1.2 6.1,21.49 8.99,21.49 R2.1 9.14,21.49 12.65,21.49 IC7.16
N$7  (via drill 0.61)
  Top 0.305: 16.54,51.59 18.75,49.38 IC3.2 | 16.54,51.59 16.46,51.67 11.28,51.67 IC3.6 11.12,51.67 7.92,51.67 6.4,50.14 6.4,49.53 10.36,45.57 11.12,45.57 13.72,42.98 13.72,42.37 v15.54,40.54 | 18.97,56.16 16.61,53.8 16.61,51.67 16.54,51.59 | 18.97,56.16 22.25,59.44 22.86,59.44 C4.2 | 18.97,56.16 11.73,63.4 10.97,63.4 10.06,64.32 10.06,65.23 10.82,65.99 11.58,65.99 12.34,66.75 12.34,66.91 22.86,77.42 C10.2 23.01,77.42 24.23,76.2 26.98,76.2 27.74,76.97 27.74,77.88 31.7,81.84 31.7,94.34 23.01,103.03 23.01,103.94 R12.2 | v16.92,39.17 19.2,36.88 20.27,36.88 IC7.7
  Bottom 0.305: v15.54,40.54 v16.92,39.17
N$8
  Top 0.305: IC3.3 18.9,51.82 18.9,52.43 21.49,55.02 R6.1 21.64,55.17 23.93,55.17 R7.2
N$9
  Top 0.305: R8.2 29.11,67.06 29.11,58.52 30.18,57.46 30.18,55.78 16.61,42.22 16.61,40.24 13.26,36.88 12.8,36.88 IC7.10 12.8,36.73 12.8,34.45 IC7.11
N$10
  Top 0.305: 27.74,57 28.96,57 R8.1 | 27.74,57 26.52,57 R9.2 | 27.74,57 27.74,67.52 25.6,69.65 25.6,71.94 C1.1
N$11
  Top 0.305: IC2.3 18.9,64.62 22.86,64.62 C4.1 23.01,64.62 25.45,67.06 26.36,67.06 R9.1
N$12
  Top 0.305: 16.54,64.55 18.75,62.34 IC2.2 | 16.54,64.55 16.46,64.62 11.28,64.62 IC2.6 | 16.54,64.55 16.61,64.62 16.61,66.75 20.42,70.56 20.42,71.94 C1.2 20.57,72.09 23.77,72.09 28.96,77.27 R10.2
N$13
  Top 0.305: 16.54,82.07 18.75,79.86 IC4.2 | 16.54,82.07 16.46,82.15 11.28,82.15 IC4.6 | 22.02,93.2 19.96,95.25 19.96,95.71 19.2,96.47 18.44,96.47 17.68,97.23 17.68,99.06 18.75,100.13 IC5.3 | 22.02,93.2 25.15,90.07 25.45,90.07 C9.2 | 22.02,93.2 16.61,87.79 16.61,82.15 16.54,82.07
N$14
  Top 0.305: C9.1 20.57,89.92 23.93,89.92 25.15,88.7 27.89,88.7 28.96,87.63 R10.1 28.96,87.48 26.52,85.04 26.52,77.42 R11.2
N$15
  Top 0.305: IC4.3 18.9,82.3 22.71,82.3 22.86,82.45 C10.1 23.01,82.6 26.36,85.96 26.36,87.48 R11.1
N$16
  Top 0.305: R14.1 109.12,83.52 110.19,83.52 114.15,87.48 +5V.A
N$17
  Top 0.305: R16.2 30.48,93.88 28.04,93.88 R13.2 27.89,93.88 25.6,93.88 R17.2 25.45,93.88 23.01,93.88 R12.1 22.86,94.03 19.2,97.69 18.9,97.69 IC5.2
N$18
  Top 0.305: R13.1 27.89,104.09 27.89,104.85 26.52,106.23 JP1.1
N$19
  Top 0.305: L2.1 23.62,31.55 26.36,31.55 R3.2 | 26.98,31.55 26.52,31.55 R3.2 | 26.98,31.55 28.96,31.55 R21.2 | IC9.6 12.8,11.74 13.11,11.74 15.54,9.3 20.27,9.3 IC9.2 20.42,9.3 21.18,9.3 24.08,12.2 24.08,13.26 24.23,13.41 24.23,14.79 25.3,15.85 25.45,15.85 27.74,18.14 27.74,25.15 26.98,25.91 26.98,31.55 | 26.98,31.55 R3.2
N$20
  Top 0.305: R4.1 112.01,82.6 114.15,82.6 +9V.A
N$21
  Top 0.305: R18.2 40.54,19.51 42.98,21.95 42.98,23.93 41.76,25.15 IC13.15 41.76,25.3 42.98,26.52 42.98,28.2 41.76,29.42 41.76,30.18 IC13.13
N$22
  Top 0.305: R16.1 30.48,104.09 30.48,106.23 JP2.1
N$23
  Top 0.305: R18.1 50.44,19.51 48.01,21.95 48.01,23.93 49.23,25.15 IC13.2 49.38,25.3 50.6,26.52 50.6,33.38 49.38,34.6 49.38,35.21 IC13.6
N$24
  Top 0.305: R17.1 25.45,104.09 25.15,104.09 23.01,106.23 JP3.1
N$25
  Top 0.305: R20.1 55.47,22.41 52.58,22.41 L4.2 52.43,22.56 49.38,22.56 IC13.1
N$26
  Top 0.305: IC1.4 92.2,43.89 92.2,48.01 93.12,48.92 C2.-
N$27
  Top 0.305: IC1.2 97.23,43.89 97.23,47.55 95.86,48.92 C2.+
N$28  (via drill 0.61)
  Top 0.305: v36.27,20.58 35.05,21.8 35.05,22.41 L3.2 | IC13.16 41.6,22.56 38.1,22.56 R19.1
  Bottom 0.305: v36.27,20.58 38.1,22.41 R19.1
N$29  (via drill 0.61)
  Top 0.305: 45.8,53.12 48.16,50.75 IC10.2 | 45.8,53.12 45.72,53.19 40.69,53.19 IC10.6 40.69,53.04 39.47,51.82 39.47,50.3 40.23,49.53 41,49.53 v46.02,44.5 | 48.23,57.38 45.87,55.02 45.87,53.19 45.8,53.12 | 48.23,57.38 51.66,60.81 51.97,60.81 C17.2 | 48.84,74.75 41,66.91 40.23,66.91 39.47,66.15 39.47,65.38 40.39,64.47 41.15,64.47 48.23,57.38 | 48.84,74.75 51.97,77.88 51.97,78.34 C21.2 | 48.84,74.75 41.15,82.45 40.39,82.45 39.47,83.37 39.47,86.72 41.91,89.16 41.91,96.47 47.85,102.42 48.62,102.42 51.21,105.01 51.97,105.01 R29.2 | v47.4,43.13 47.4,40.39 49.23,38.56 49.23,37.95 IC13.7
  Bottom 0.305: v46.02,44.5 v47.4,43.13
N$30
  Top 0.305: IC10.3 48.31,53.34 50.9,55.93 R23.1 51.05,56.09 53.95,56.09 R24.2
N$31
  Top 0.305: R25.2 58.37,58.37 58.37,55.48 44.81,41.91 44.81,40.39 42.37,37.95 41.76,37.95 IC13.10 41.76,37.8 41.76,35.36 IC13.11
N$32
  Top 0.305: C16.1 54.56,73.46 54.56,72.39 58.37,68.58 R25.1 58.37,68.43 56.08,66.15 56.08,58.52 R26.2
N$33
  Top 0.305: IC6.3 48.31,65.84 51.82,65.84 51.97,65.99 C17.1 52.12,66.15 54.41,68.43 55.93,68.43 R26.1
N$34
  Top 0.305: 45.8,65.61 48.16,63.25 IC6.2 | 45.8,65.61 45.72,65.69 40.69,65.69 IC6.6 | 45.8,65.61 45.87,65.69 45.87,67.52 49.38,71.02 49.38,73.46 C16.2 49.53,73.61 50.6,74.68 54.86,74.68 57.45,77.27 58.37,77.27 R27.2
N$35
  Top 0.305: R27.1 58.37,87.63 56.08,87.63 R28.2 56.08,87.79 54.56,89.31 54.56,90.99 C20.1
N$36
  Top 0.305: IC11.3 48.31,83.67 51.97,83.67 C21.1 52.12,83.52 55.93,79.71 55.93,77.42 R28.1
N$37
  Top 0.305: 45.8,83.59 48.16,81.23 IC11.2 | 45.8,83.59 45.72,83.67 40.69,83.67 IC11.6 | 45.8,83.59 45.87,83.67 45.87,85.5 49.38,89 49.38,90.99 C20.2 49.38,91.14 47.09,93.42 47.09,99.22 48.16,100.28 48.16,101.2 IC12.3
N$38
  Top 0.305: R31.2 59.44,94.95 57.15,94.95 R30.2 56.84,94.95 54.56,94.95 R32.2 54.41,94.95 52.12,94.95 R29.1 51.97,94.95 48.31,98.61 IC12.2
N$39
  Top 0.305: R5.1 109.12,71.02 109.12,72.39 114.15,77.42 -9V.A
N$40
  Top 0.305: R30.1 57,105.16 57,106.68 56.08,107.6 JP4.1
N$41
  Top 0.305: R31.1 59.59,105.16 59.59,107.6 JP5.1
N$42
  Top 0.305: R32.1 54.41,105.16 51.97,107.6 JP6.1
N$43
  Top 0.305: R33.2 69.95,19.51 72.54,22.1 72.54,23.93 71.32,25.15 IC18.15 71.32,25.3 74.07,28.05 74.07,29.57 73.3,30.33 71.32,30.33 IC18.13
N$44
  Top 0.305: R33.1 80.01,19.51 77.42,22.1 77.42,23.78 78.79,25.15 IC18.2 78.94,25.3 80.16,26.52 80.16,33.23 78.94,34.45 78.94,35.21 IC18.6
N$45
  Top 0.305: R35.1 85.5,22.41 82.6,22.41 L6.2 82.45,22.56 78.94,22.56 IC18.1
N$46  (via drill 0.61)
  Top 0.559: C14.2 105.46,82.45 104.09,81.08 101.8,81.08 IC8.3 101.65,80.78 101.65,78.49 97.84,74.68 C15.+ 97.69,74.37 93.12,74.37 92.51,74.98 | 92.51,74.98 91.59,75.9 D2.C | 92.51,74.98 90.07,72.55 90.07,70.11 91.9,68.28 91.9,67.67 D1.C 91.9,67.36 91.9,63.55 v87.78,59.44 | 100.28,56.39 100.89,55.78 C53.+ | 100.28,56.39 99.36,57.31 99.36,59.44 7809L.IN 99.36,59.74 100.89,61.27 100.89,63.86 C57.2 | 99.82,33.53 99.82,36.12 IC1.8 99.82,36.43 106.38,42.98 J1.3 | 99.82,33.53 100.43,32.92 C63.+ | 100.28,56.39 94.34,50.45 92.66,50.45 | 92.66,50.45 89.61,47.4 89.61,31.25 90.68,30.18 96.47,30.18 99.82,33.53 | v88.09,56.39 88.09,55.02 92.66,50.45
  Bottom 0.559: v87.78,59.44 87.78,56.7 v88.09,56.39
N$52
  Top 0.305: L5.2 64.62,22.41 67.36,22.41 R34.1 67.51,22.56 71.17,22.56 IC18.16
N$53
  Top 0.305: 81.31,42.9 81.53,42.67 81.53,42.07 80.16,40.69 80.16,39.17 78.94,37.95 IC18.7 | 81.31,42.9 78.79,45.42 78.79,48.31 77.42,49.69 77.42,50.6 IC15.2 | 76.73,57.84 79.7,60.81 80.47,60.81 C28.2 80.62,60.81 82.75,60.81 84.73,58.83 84.73,46.33 81.31,42.9 | 76.73,57.84 72.24,53.34 69.8,53.34 IC15.6 | 77.8,74.91 70.87,67.97 70.87,67.82 69.95,66.91 69.19,66.91 68.43,66.15 68.43,65.38 69.34,64.47 70.1,64.47 76.73,57.84 | 77.8,74.91 78.18,75.29 78.33,75.29 81.38,78.34 C32.2 | 77.8,74.91 70.26,82.45 69.34,82.45 68.43,83.37 68.43,86.72 70.87,89.16 70.87,96.47 76.81,102.42 77.57,102.42 80.16,105.01 81.38,105.01 R44.2
N$54
  Top 0.305: R38.1 82.45,45.88 80.01,45.88 R39.2 79.86,46.03 79.86,49.84 77.42,52.28 77.42,53.19 IC15.3
N$55
  Top 0.305: R40.2 83.36,58.37 78.18,58.37 73.61,53.8 73.61,47.4 72.85,46.64 72.85,44.05 72.54,43.74 72.54,39.17 71.32,37.95 IC18.10 71.17,37.8 71.17,35.36 IC18.11
N$56
  Top 0.305: 83.29,69.27 79.1,73.46 C27.1 | 83.29,69.27 83.36,69.19 83.36,68.58 R40.1 | 83.29,69.27 83.82,69.8 86.87,69.8 87.63,69.04 87.63,68.13 86.56,67.06 86.56,58.52 R41.2
N$57
  Top 0.305: IC14.3 77.42,65.84 80.31,65.84 80.47,65.99 C28.1 80.62,66.15 82.75,66.15 85.04,68.43 86.41,68.43 R41.1
N$58  (via drill 0.61)
  Top 0.559: C12.- 91.59,32.16 92.05,32.62 92.05,36.12 IC1.5 92.35,36.43 97.69,41.76 100.28,41.76 102.26,43.74 v102.26,50.6 | 7909L.IN 104.09,61.42 104.09,63.86 C55.1 104.24,64.01 105.31,65.08 108.36,65.08 C54.- 108.66,65.38 109.27,65.99 112.78,65.99 | 112.78,65.99 114.45,65.99 D4.A | v103.94,52.28 105.16,52.28 v109.58,56.7 | v111.25,58.37 111.71,58.37 112.78,59.44 112.78,65.99
  Bottom 0.559: v103.94,52.28 v102.26,50.6 | v111.25,58.37 v109.58,56.7
N$60
  Top 0.305: 76.05,63.25 72.24,63.25 69.8,65.69 IC14.6 | 76.05,63.25 77.27,63.25 IC14.2 | 82.75,73.61 80.47,73.61 79.4,74.68 78.49,74.68 76.05,72.24 76.05,63.25 | 82.75,73.61 83.97,73.61 C27.2 | 82.75,73.61 82.75,78.79 79.1,82.45 76.96,82.45 76.05,83.37 76.05,84.13 76.81,84.89 77.57,84.89 78.64,85.96 84.89,85.96 R42.2
N$61
  Top 0.305: R42.1 85.04,75.9 85.8,75.9 87.02,74.68 87.94,74.68 88.7,75.44 88.7,84.89 87.63,85.96 R43.2 87.48,86.11 84.12,89.46 84.12,90.99 C31.1
N$62
  Top 0.305: R43.1 87.48,76.05 87.48,77.58 81.53,83.52 C32.1 81.38,83.67 77.42,83.67 IC16.3
N$63
  Top 0.305: 74.91,83.59 77.27,81.23 IC16.2 | 74.91,83.59 74.83,83.67 69.8,83.67 IC16.6 | 74.91,83.59 74.98,83.67 74.98,85.65 78.94,89.61 78.94,90.99 C31.2 78.94,91.14 76.05,94.03 76.05,99.06 77.27,100.28 77.27,101.2 IC17.3
N$64
  Top 0.305: R46.2 88.85,94.95 86.56,94.95 R45.2 86.41,94.95 84.12,94.95 R47.2 83.97,94.95 81.53,94.95 R44.1 81.38,94.95 77.72,98.61 77.42,98.61 IC17.2
N$66
  Top 0.305: R45.1 86.41,105.16 86.41,106.23 85.04,107.6 JP7.1
N$67
  Top 0.305: R46.1 89,105.16 89,107.6 JP8.1
N$68
  Top 0.305: R47.1 83.97,105.16 83.97,105.46 81.84,107.6 81.53,107.6 JP9.1
VCC  (via drill 0.61)
  Top 0.559: C5.1 9.14,61.12 10.06,61.12 11.12,62.18 IC2.7 | C5.1 8.99,60.81 8.99,55.17 7.62,53.8 7.62,53.34 C56.+ 7.32,53.04 6.1,51.82 v6.1,51.21 | C5.1 8.99,61.27 7.62,62.64 7.62,63.71 C62.+ 7.47,64.01 8.99,65.53 8.99,79.71 C6.1 | v7.47,49.84 7.62,49.69 8.84,49.69 C13.1 9.14,49.38 11.12,49.38 IC3.7 11.43,49.23 11.89,49.23 v17.07,44.05 | C11.1 9.14,97.54 10.97,97.54 11.12,97.69 IC5.7 | C50.+ 7.62,101.2 7.62,98.91 8.84,97.69 C11.1 | C6.1 9.14,79.86 11.12,79.86 IC4.7 | C6.1 8.84,80.17 7.62,81.39 7.62,83.67 C47.+ 7.62,83.98 8.99,85.35 8.99,97.23 C11.1 | C25.1 38.1,98.91 40.39,98.91 40.54,98.76 IC12.7 | C51.+ 37.03,101.2 37.03,100.13 37.95,99.22 C25.1 | C23.1 38.1,81.08 40.54,81.08 IC11.7 | C23.1 37.95,81.23 37.03,82.15 37.03,84.58 C48.+ 37.19,84.89 38.41,86.11 38.41,98.76 C25.1 | C22.1 38.1,63.4 40.39,63.4 40.54,63.25 IC6.7 | C22.1 37.95,63.71 37.03,64.62 37.03,65.69 C61.+ 37.03,65.99 38.56,67.52 38.56,80.93 C23.1 | C26.1 37.95,50.45 36.73,49.23 26.52,49.23 22.25,44.96 21.64,44.96 R6.2 21.34,45.11 18.9,42.67 v18.44,42.67 | v39.17,49.23 38.1,50.3 C26.1 | C26.1 37.95,50.75 37.03,51.67 37.03,54.1 C58.+ 37.19,54.41 38.41,55.63 38.41,63.25 C22.1 | 99.21,84.58 99.21,86.57 100.13,87.48 C46.+ 100.43,87.33 101.65,86.11 103.94,86.11 C24.2 104.09,86.26 108.97,91.14 108.97,93.58 R14.2 | 99.21,84.58 99.21,81.08 IC8.1 99.06,81.08 94.03,76.05 D3.C | 99.21,84.58 93.42,84.58 92.05,85.96 91.59,85.96 D2.A 91.29,86.26 91.29,96.02 82.75,104.55 82.75,105.62 81.99,106.38 78.03,106.38 70.41,98.76 69.95,98.76 IC17.7 69.65,98.76 69.49,98.91 67.67,98.91 C36.1 | C52.+ 66.14,101.2 66.14,100.44 67.36,99.22 C36.1
  Top 0.559: C35.1 67.67,81.08 69.65,81.08 IC16.7 | C35.1 67.51,81.23 66.14,82.6 66.14,84.58 C49.+ 66.14,84.89 67.51,86.26 67.51,98.76 C36.1 | C34.1 67.67,63.4 69.49,63.4 69.65,63.25 IC14.7 | C34.1 67.36,63.71 66.14,64.93 66.14,67.21 C59.+ 66.29,67.36 67.51,68.58 67.51,80.78 C35.1 | C37.1 67.51,50.45 66.29,49.23 55.47,49.23 52.27,46.03 51.05,46.03 R23.2 50.75,45.88 49.99,45.11 v49.38,45.11 | C37.1 67.67,50.6 69.65,50.6 IC15.7 69.8,50.45 v72.54,47.7 | v73.91,46.33 74.37,46.79 74.37,52.12 76.81,54.56 80.31,54.56 81.69,55.93 82.45,55.93 R38.2 | C37.1 67.51,50.75 66.14,52.12 66.14,54.1 C60.+ 66.14,54.41 67.51,55.78 67.51,63.25 C34.1 | v48.01,46.48 43.89,50.6 40.69,50.6 IC10.7
  Bottom 0.559: v6.1,51.21 v7.47,49.84 | v39.17,49.23 40.54,50.6 IC10.7 | v18.44,42.67 v17.07,44.05 | v72.54,47.7 v73.91,46.33 | v49.38,45.11 v48.01,46.48
X+  (via drill 0.61)
  Top 0.305: v23.01,12.5 22.4,11.89 20.42,11.89 IC9.3 | v26.06,12.5 30.02,12.5 39.01,3.51 v41.6,3.51 | v43.74,5.64 44.96,5.64 46.63,3.97 v65.84,3.97 | v67.97,6.1 69.95,6.1 70.71,6.86 80.47,6.86 v81.08,6.25 | v82.75,4.58 82.75,5.18 90.59,13.02 90.59,18.96 v92.12,20.49 | v94.75,22.86 95.71,22.86 96.47,23.62 101.35,23.62 GEOIN.2
  Bottom 0.305: v26.06,12.5 v23.01,12.5 | v43.74,5.64 v41.6,3.51 | v67.97,6.1 v65.84,3.97 | v82.75,4.58 v81.08,6.25 | v94.75,22.86 v92.12,20.49
X-  (via drill 0.61)
  Top 0.305: 4.88,31.55 5.94,31.55 L1.1 6.1,31.55 8.99,31.55 R2.2 | 4.88,31.55 3.05,31.55 R15.2 | v74.98,3.2 75.29,2.9 86.19,2.9 101.35,18.05 101.35,21.19 GEOIN.1 | v76.66,4.88 76.05,4.88 75.74,5.18 72.39,5.18 71.63,4.42 69.49,4.42 v68.89,5.03 | v66.75,2.9 45.11,2.9 42.37,5.64 v42.37,6.1 | v40.54,4.58 38.86,4.58 29.57,13.87 29.57,15.55 v28.8,16.31 | v26.67,18.44 23.16,18.44 22.1,17.38 8.38,17.38 4.88,20.88 4.88,31.55
  Bottom 0.305: v76.66,4.88 v74.98,3.2 | v66.75,2.9 v68.89,5.03 | v42.37,6.1 40.84,4.58 v40.54,4.58 | v26.67,18.44 v28.8,16.31
XOUT
  Top 0.305: IC5.6 11.28,100.28 14.48,100.28 22.86,108.66 JP3.2 23.01,108.82 26.36,108.82 JP1.2 26.52,108.82 30.48,108.82 JP2.2 30.63,108.82 33.98,112.17 97.69,112.17 101.65,108.21 101.65,107.29 102.41,106.53 103.33,106.53 104.24,105.62 104.24,104.85 103.33,103.94 102.56,103.94 101.35,105.16 100.43,105.16 ASPOUT.1
Y+  (via drill 0.61)
  Top 0.305: v56.39,10.67 54.71,9 45.11,9 42.67,11.43 41.91,11.43 41,12.35 41,13.26 41.76,14.02 42.52,14.02 43.74,12.8 49.68,12.8 IC19.3 | v58.06,12.35 64.47,18.75 v64.62,18.75 | v66.29,20.43 67.36,20.43 69.49,18.29 83.06,18.29 86.72,21.95 86.72,25.3 81.38,30.64 81.38,33.07 82.14,33.84 85.95,33.84 87.94,31.86 87.94,28.05 90.98,25 102.72,25 103.94,23.78 GEOIN.4
  Bottom 0.305: v58.06,12.35 v56.39,10.67 | v66.29,20.43 v64.62,18.75
Y-
  Top 0.305: R22.2 32,32.62 34.9,32.62 L3.1 35.05,32.62 36.88,32.62 | 36.88,32.62 37.95,32.62 R19.2 | 36.88,32.62 36.88,21.34 40.23,17.99 40.23,10.52 41.76,9 42.52,9 45.87,5.64 65.53,5.64 69.04,2.14 86.34,2.14 103.94,19.73 103.94,21.19 GEOIN.3
YOUT
  Top 0.305: IC12.6 40.69,101.35 43.13,101.35 51.97,110.19 JP6.2 52.12,110.34 55.93,110.34 JP4.2 56.08,110.34 59.44,110.34 JP5.2 59.59,110.34 60.81,111.56 90.22,111.56 93.88,107.9 100.28,107.9 ASPOUT.2
Z+
  Top 0.305: IC20.3 78.94,10.82 78.94,11.74 80.31,13.11 80.31,13.57 88.54,21.8 95.56,21.8 96.32,22.56 105.31,22.56 106.38,23.62 GEOIN.6
Z-  (via drill 0.61)
  Top 0.305: v62.79,34.45 62.03,33.68 62.03,32.62 R48.2 | L5.1 64.62,32.62 67.36,32.62 R34.2 67.51,32.46 67.51,32.01 70.56,28.96 71.78,28.96 72.08,29.26 v73,29.26 | v74.37,30.64 74.37,32.77 78.18,36.58 79.4,36.58 79.55,36.43 84.28,36.43 88.54,32.16 88.54,31.25 90.83,28.96 103.02,28.96 107.75,24.23 107.75,23.32 106.53,22.1 106.53,21.34 GEOIN.5
  Bottom 0.305: v62.79,34.45 64.62,32.62 L5.1 | v73,29.26 v74.37,30.64
ZOUT
  Top 0.305: IC17.6 69.8,101.35 71.93,101.35 80.77,110.19 81.38,110.19 JP9.2 81.53,110.34 84.89,110.34 JP7.2 85.04,110.34 88.85,110.34 JP8.2 89,110.19 92.66,106.53 100.89,106.53 102.11,105.31 102.87,105.31 ASPOUT.3

### Text on the board
Document: 50db | 60db | 80db | 50db | 60db | 80db | 50db | 60db | 80db